# EasyEDA schematic SCH_PIEZO_CRYSTAL_DAC_2022-01-11.json

## Sheets
1 DACs: TITLE: Sheet_1; REV: 1.0; Date: 2021-10-22; Sheet: 1/1; Drawn By: Dimsmary; Company: Your Company
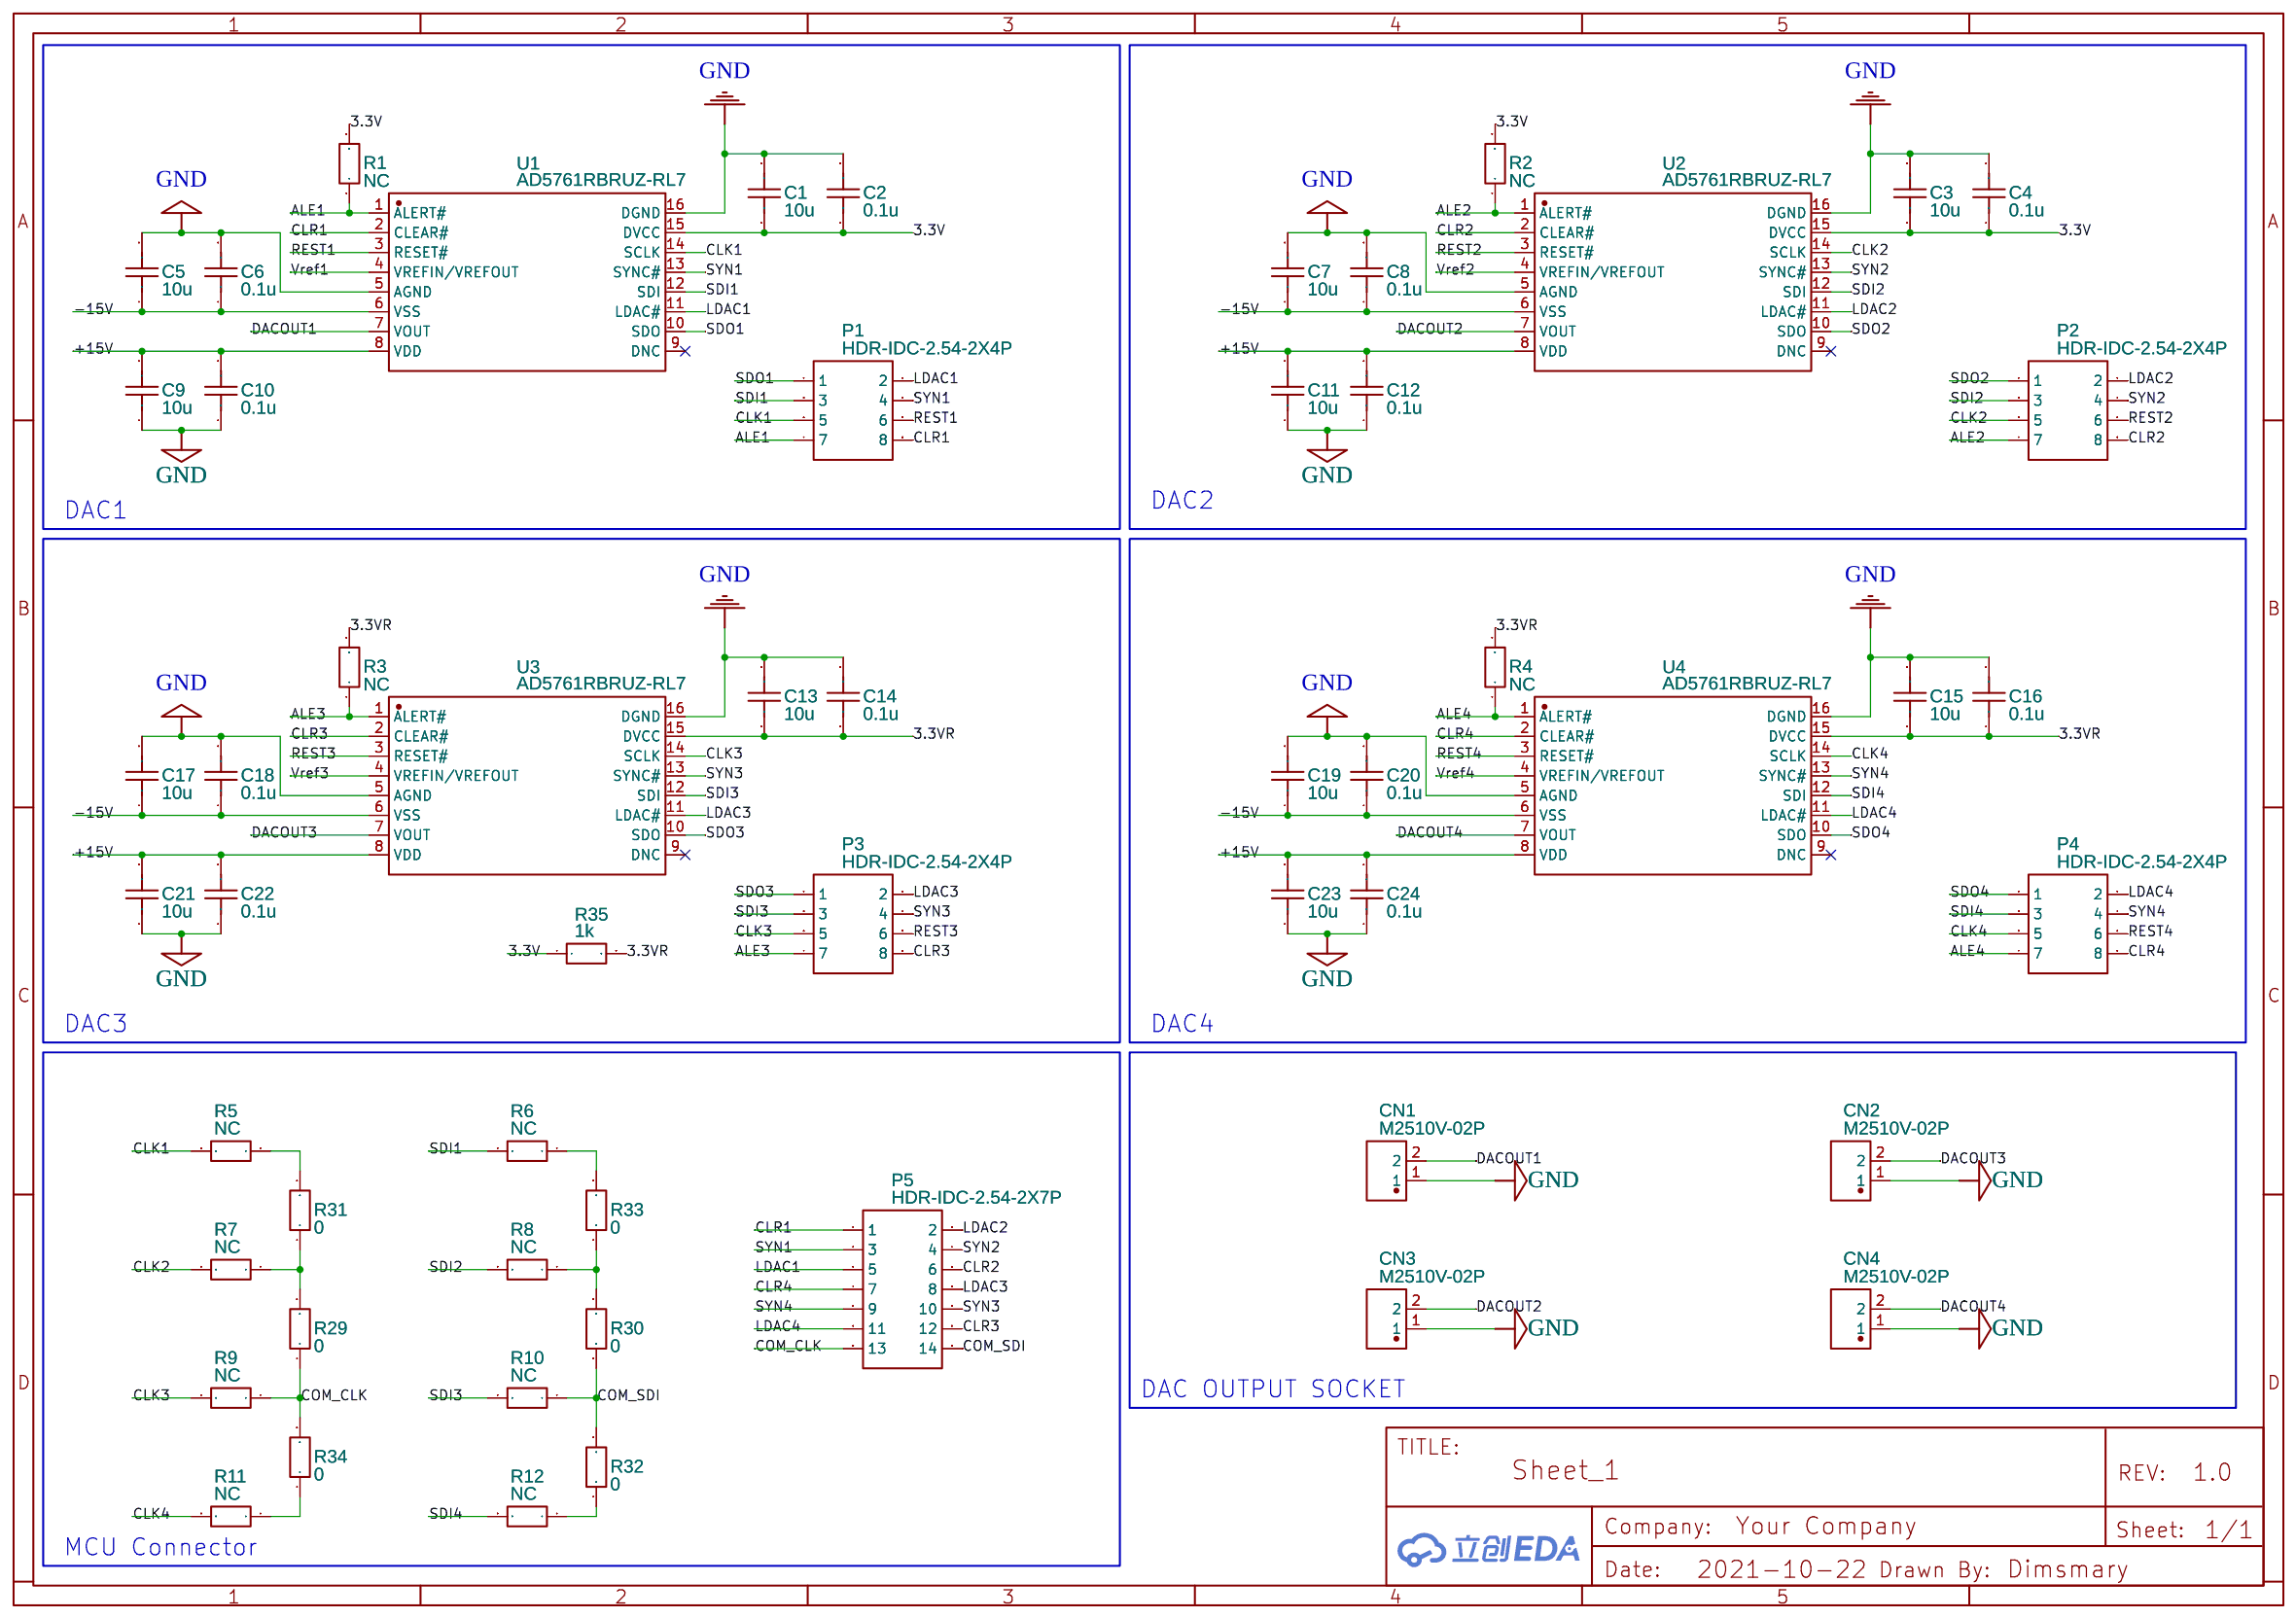
[diagram p0: DACs]
2 PowerRail: TITLE: Sheet_2; Date: 2021-10-23
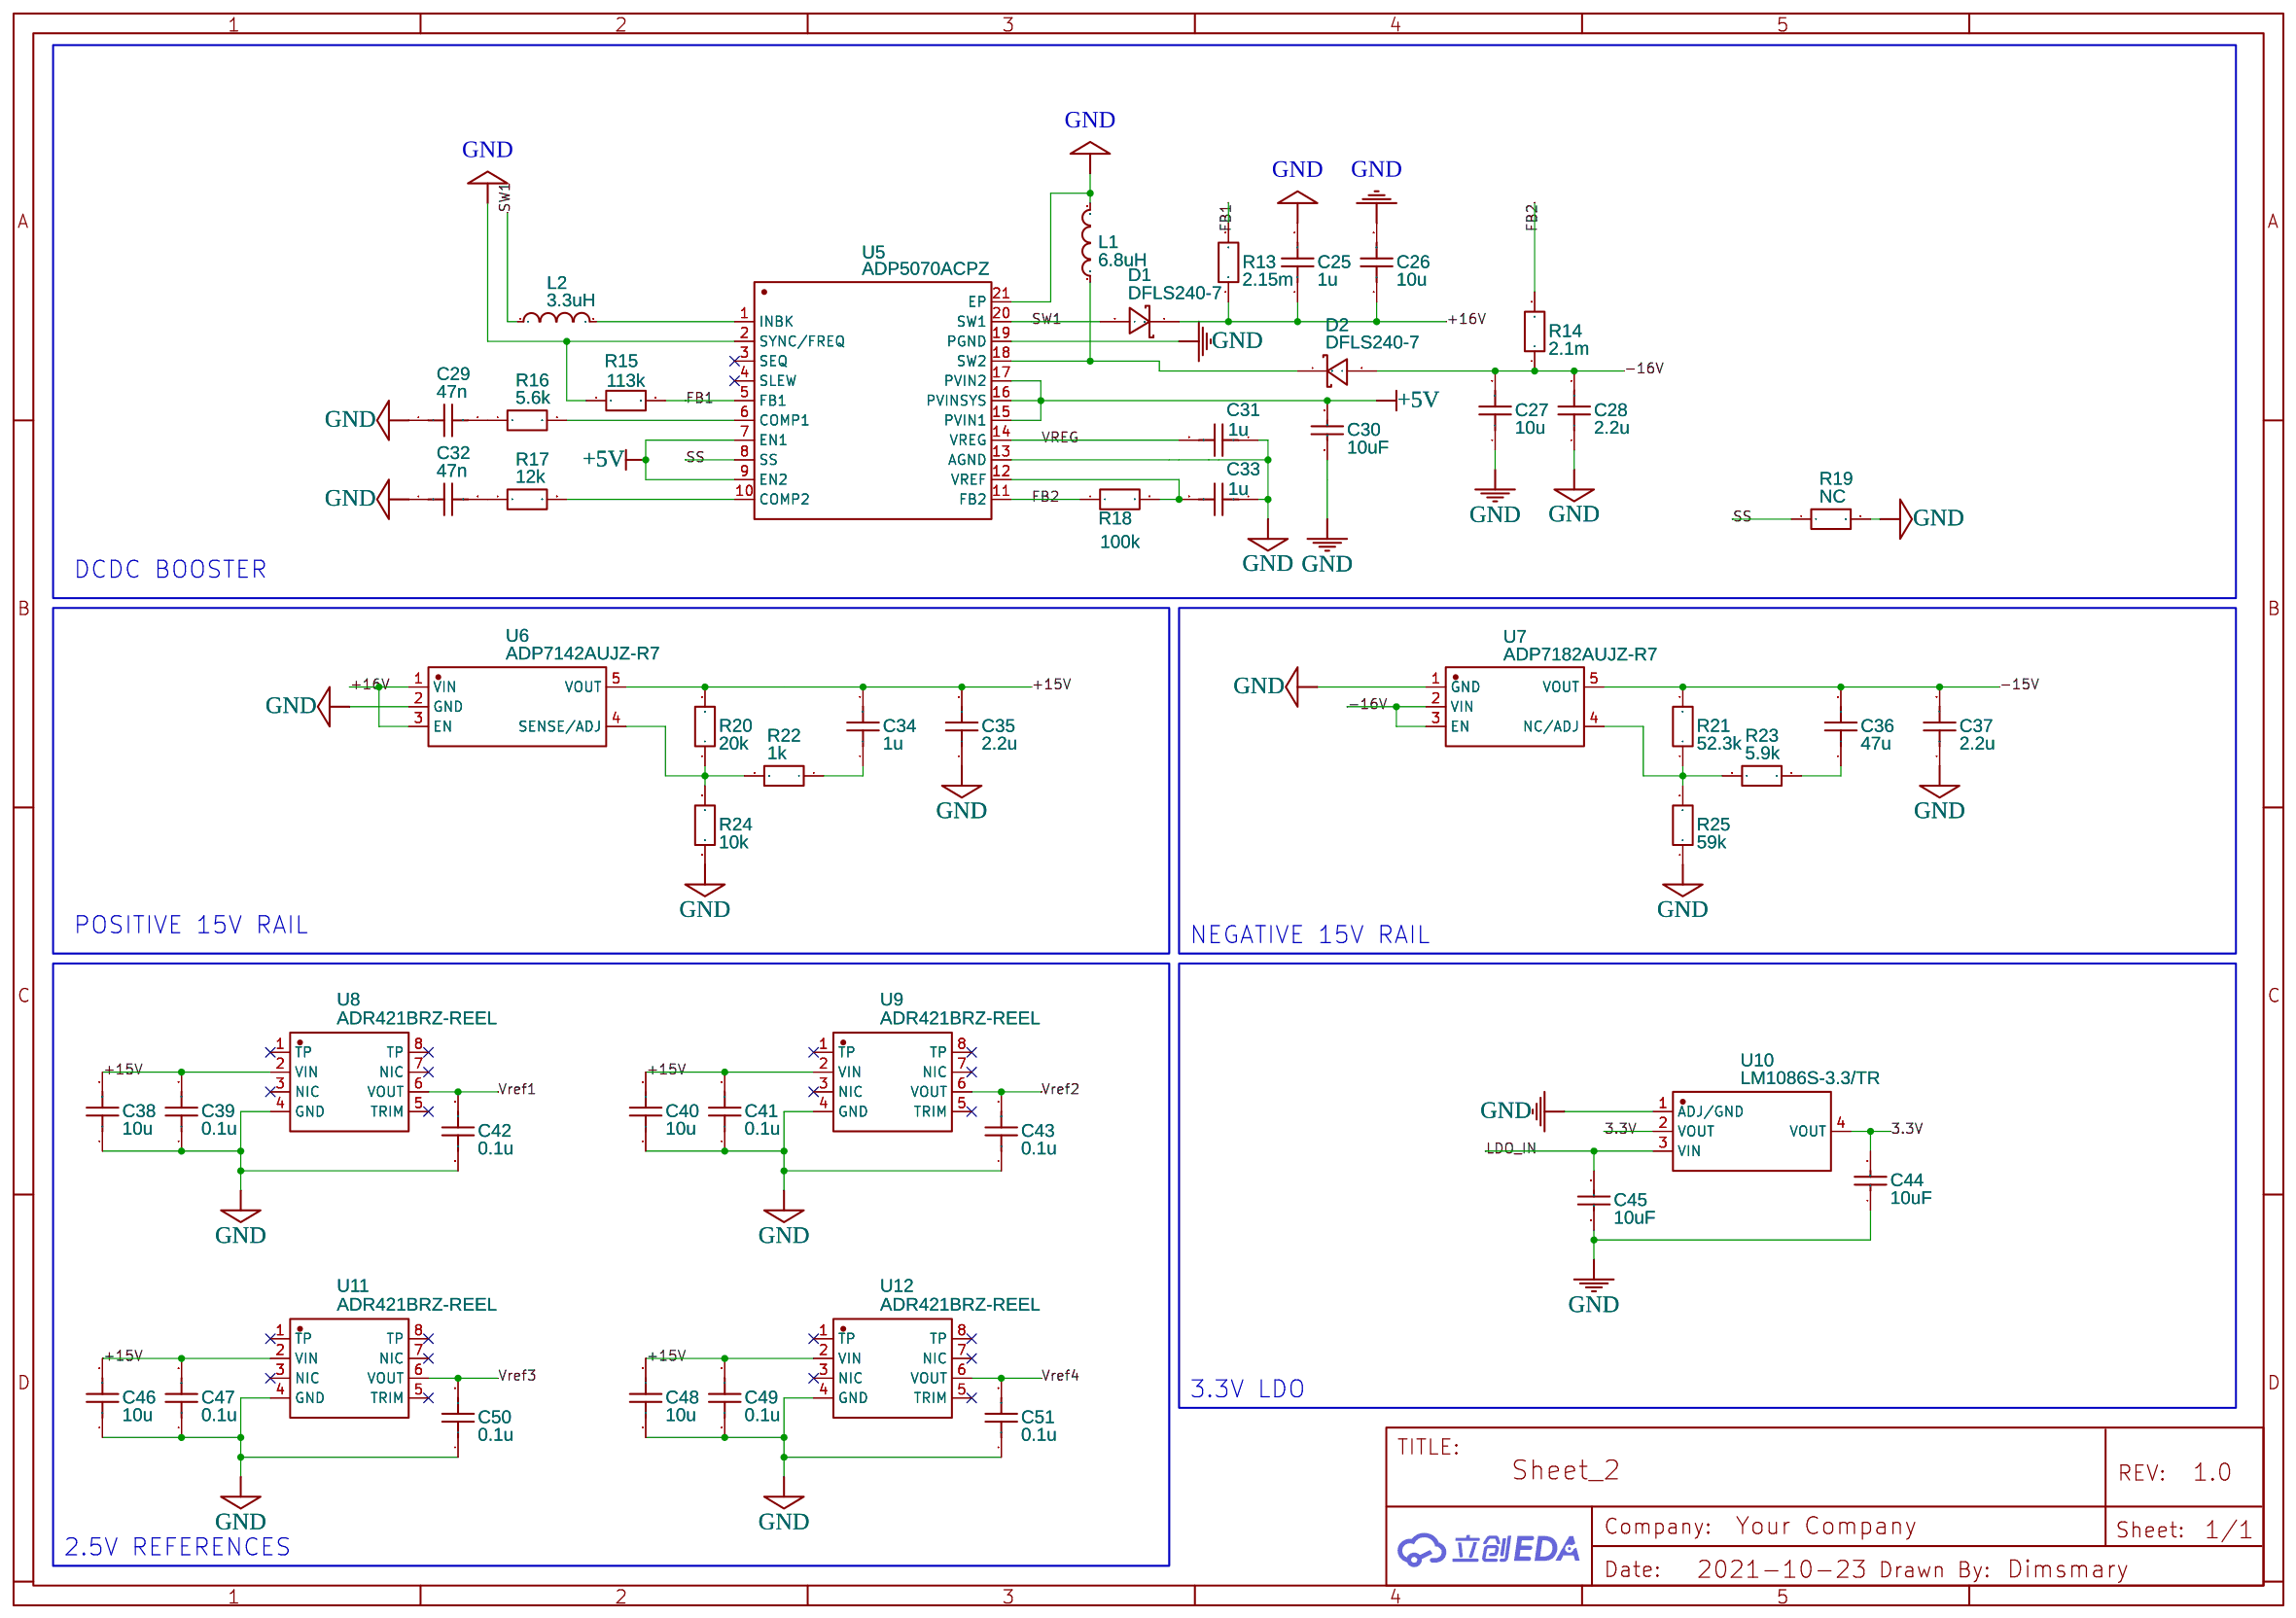
[diagram p1: PowerRail]
3 PowerInput: Date: 2021-10-25
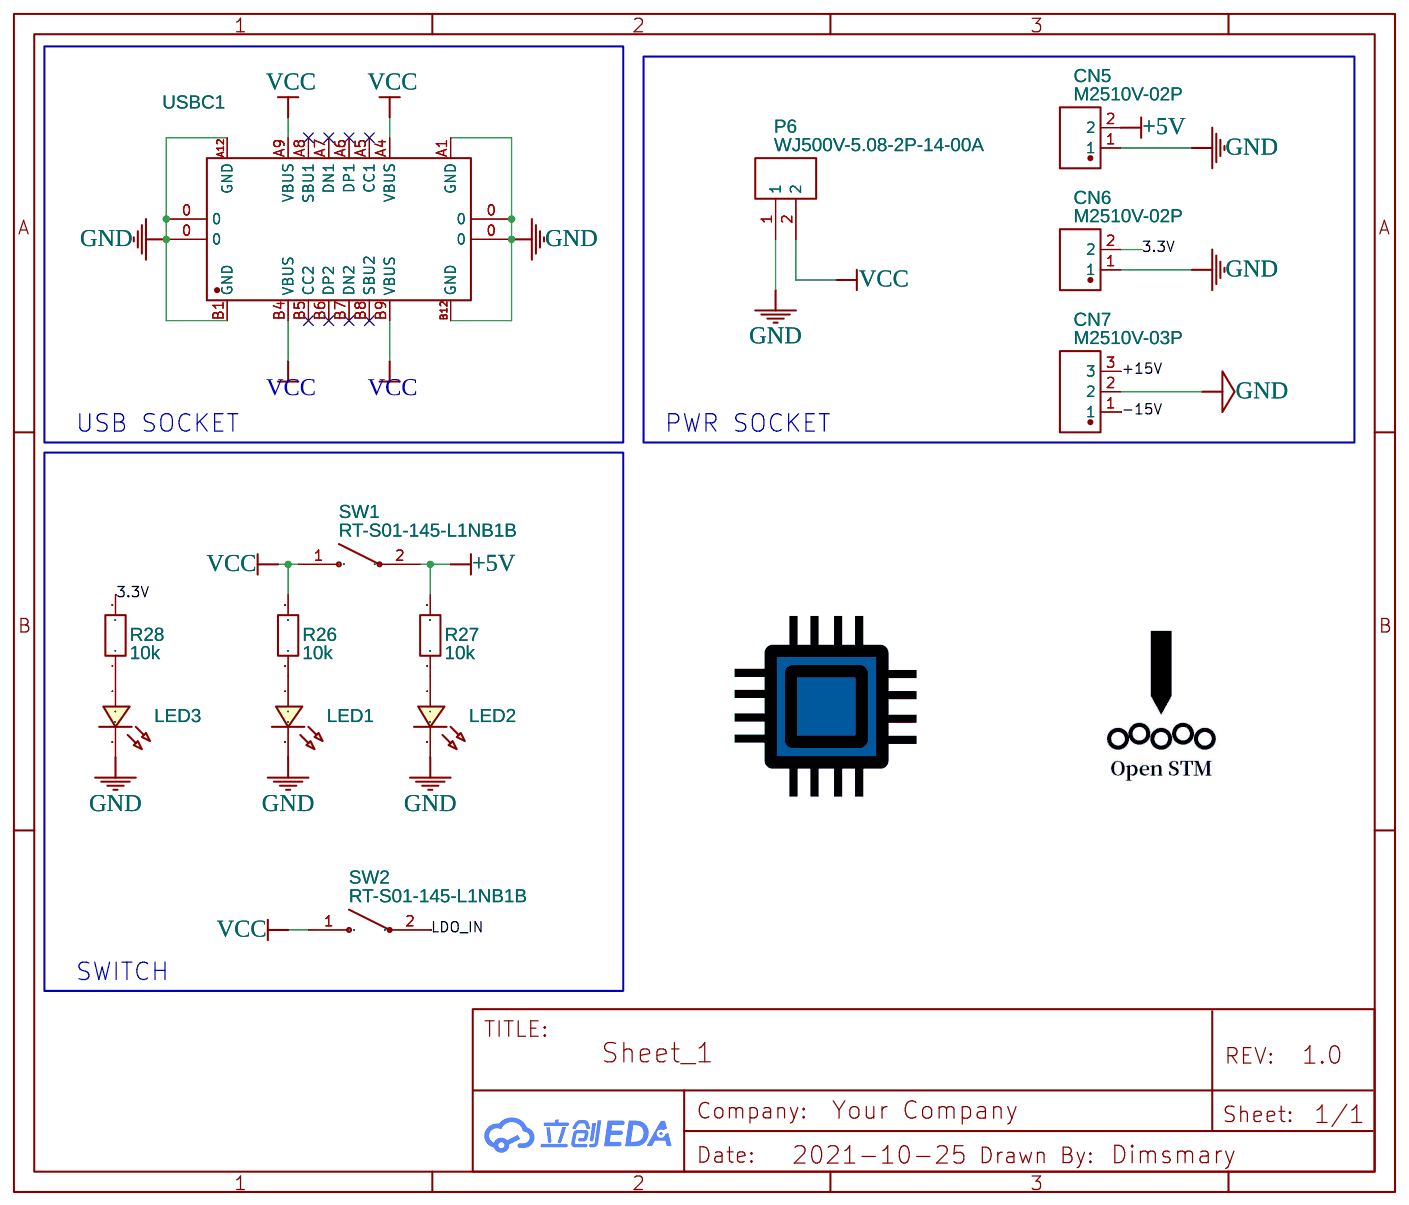
[diagram p2: PowerInput]

## Parts
sheet DACs
C1  10u  [C0603]
C2  0.1u  [C0603]
C3  10u  [C0603]
C4  0.1u  [C0603]
C5  10u  [C0603]
C6  0.1u  [C0603]
C7  10u  [C0603]
C8  0.1u  [C0603]
C9  10u  [C0603]
C10  0.1u  [C0603]
C11  10u  [C0603]
C12  0.1u  [C0603]
C13  10u  [C0603]
C14  0.1u  [C0603]
C15  10u  [C0603]
C16  0.1u  [C0603]
C17  10u  [C0603]
C18  0.1u  [C0603]
C19  10u  [C0603]
C20  0.1u  [C0603]
C21  10u  [C0603]
C22  0.1u  [C0603]
C23  10u  [C0603]
C24  0.1u  [C0603]
CN1  M2510V-02P  [CONN-TH_M2510V-02P]
CN2  M2510V-02P  [CONN-TH_M2510V-02P]
CN3  M2510V-02P  [CONN-TH_M2510V-02P]
CN4  M2510V-02P  [CONN-TH_M2510V-02P]
P1  HDR-IDC-2.54-2X4P  [IDC-TH_8P-P2.54-V-R2-C4-S2.54]
P2  HDR-IDC-2.54-2X4P  [IDC-TH_8P-P2.54-V-R2-C4-S2.54]
P3  HDR-IDC-2.54-2X4P  [IDC-TH_8P-P2.54-V-R2-C4-S2.54]
P4  HDR-IDC-2.54-2X4P  [IDC-TH_8P-P2.54-V-R2-C4-S2.54]
P5  HDR-IDC-2.54-2X7P  [IDC-TH_14P-P2.54-V-R2-C7-S2.54]
R1  NC  [R0603]
R2  NC  [R0603]
R3  NC  [R0603]
R4  NC  [R0603]
R5  NC  [R0603]
R6  NC  [R0603]
R7  NC  [R0603]
R8  NC  [R0603]
R9  NC  [R0603]
R10  NC  [R0603]
R11  NC  [R0603]
R12  NC  [R0603]
R29  0  [R1206]
R30  0  [R1206]
R31  0  [R1206]
R32  0  [R1206]
R33  0  [R1206]
R34  0  [R1206]
R35  1k  [R2512]
U1  AD5761RBRUZ-RL7  [TSSOP-16_L5.0-W4.4-P0.65-LS6.4-BL]
U2  AD5761RBRUZ-RL7  [TSSOP-16_L5.0-W4.4-P0.65-LS6.4-BL]
U3  AD5761RBRUZ-RL7  [TSSOP-16_L5.0-W4.4-P0.65-LS6.4-BL]
U4  AD5761RBRUZ-RL7  [TSSOP-16_L5.0-W4.4-P0.65-LS6.4-BL]
sheet PowerInput
CN5  M2510V-02P  [CONN-TH_M2510V-02P]
CN6  M2510V-02P  [CONN-TH_M2510V-02P]
CN7  M2510V-03P  [CONN-TH_M2510V-03P]
LED1  LED-0603_R  [LED0603_RED]
LED2  LED-0603_R  [LED0603_RED]
LED3  LED-0603_R  [LED0603_RED]
P6  WJ500V-5.08-2P-14-00A  [CONN-TH_2P-P5.00_WJ500V-5.08-2P]
R26  10k  [R0603]
R27  10k  [R0603]
R28  10k  [R0603]
SW1  RT-S01-145-L1NB1B  [SW-TH_RT-S01-145-L1NB1B]
SW2  RT-S01-145-L1NB1B  [SW-TH_RT-S01-145-L1NB1B]
USBC1  TYPE-C-31-M-12  [USB-TYPE-C_16PIN-MALE-TYPE-C-31-M-12-AK]
sheet PowerRail
C25  1u  [C0603]
C26  10u  [C0603]
C27  10u  [C0603]
C28  2.2u  [C0603]
C29  47n  [C0603]
C30  10uF  [C0805]
C31  1u  [C0603]
C32  47n  [C0603]
C33  1u  [C0603]
C34  1u  [C0603]
C35  2.2u  [C0603]
C36  47u  [C0603]
C37  2.2u  [C0603]
C38  10u  [C0603]
C39  0.1u  [C0603]
C40  10u  [C0603]
C41  0.1u  [C0603]
C42  0.1u  [C0603]
C43  0.1u  [C0603]
C44  10uF  [C0805]
C45  10uF  [C0805]
C46  10u  [C0603]
C47  0.1u  [C0603]
C48  10u  [C0603]
C49  0.1u  [C0603]
C50  0.1u  [C0603]
C51  0.1u  [C0603]
D1  DFLS240-7  [POWERDI-123_L2.8-W1.8-LS3.7-RD]
D2  DFLS240-7  [POWERDI-123_L2.8-W1.8-LS3.7-RD]
L1  6.8uH  [L0806]
L2  3.3uH  [IND-SMD_L2.0-W1.6]
R13  2.15m  [R0603]
R14  2.1m  [R0603]
R15  113k  [R0603]
R16  5.6k  [R0603]
R17  12k  [R0603]
R18  100k  [R0603]
R19  NC  [R0603]
R20  20k  [R0603]
R21  52.3k  [R0603]
R22  1k  [R0603]
R23  5.9k  [R0603]
R24  10k  [R0603]
R25  59k  [R0603]
U5  ADP5070ACPZ  [LFCSP-20_L4.0-W4.0-P0.50-TL-EP2.7]
U6  ADP7142AUJZ-R7  [TSOT-23-5_L2.9-W1.6-P0.95-LS2.8-BR]
U7  ADP7182AUJZ-R7  [TSOT-23-5_L2.9-W1.6-P0.95-LS2.8-BR]
U8  ADR421BRZ-REEL  [SOIC-8_L4.9-W3.9-P1.27-LS6.0-BL]
U9  ADR421BRZ-REEL  [SOIC-8_L4.9-W3.9-P1.27-LS6.0-BL]
U10  LM1086S-3.3/TR  [TO-263-3_L8.6-W10.2-P2.54-LS14.4-BR]
U11  ADR421BRZ-REEL  [SOIC-8_L4.9-W3.9-P1.27-LS6.0-BL]
U12  ADR421BRZ-REEL  [SOIC-8_L4.9-W3.9-P1.27-LS6.0-BL]

## Library data of the parts
C1-C29 C31-C43 C46-C51 = C_0603_US: Contributor: LCEDA_Lib
CN1-CN6 = M2510V-02P: Supplier: LCSC; Supplier Part: C2764790; Manufacturer: XFCN(台湾兴飞); JLCPCB Part Class: Extended Part; Contributor: LCSC
P1-P4 = HDR-IDC-2.54-2X4P: Supplier: LCSC; Manufacturer: BOOMELE; Manufacturer Part: IDC Box 2X4 2.54MM; image: //image.lceda.cn/szlcsc/C9135.jpg; Supplier Part: C9135
P5 = HDR-IDC-2.54-2X7P: Supplier: LCSC; Manufacturer: BOOMELE; Manufacturer Part: 2X7 2.54mm IDC Box; image: //image.lceda.cn/szlcsc/C11215.jpg; Supplier Part: C11215
R1-R28 = R_0603_EU: Contributor: LCEDA_Lib
R29-R34 = R_1206_EU: Contributor: LCEDA_Lib
R35 = R_2512_EU: Contributor: LCEDA_Lib
U1-U4 = AD5761RBRUZ-RL7: Supplier: LCSC; Supplier Part: C515877; Manufacturer: Analog Devices; Contributor: LCSC; JLCPCB Part Class: Extended Part
CN7 = M2510V-03P: Supplier: LCSC; Supplier Part: C2764791; Manufacturer: XFCN(台湾兴飞); JLCPCB Part Class: Extended Part; Contributor: LCSC
LED1-LED3 = LED-0603_R: Manufacturer: EVERLIGHT(台湾亿光); Manufacturer Part: 19-217/R6C-AL1M2VY/3T; Supplier Part: C72044; Supplier: LCSC; Contributor: LCEDA_01
P6 = WJ500V-5.08-2P-14-00A: Supplier: LCSC; Manufacturer: ReliaPro; Supplier Part: C8465; JLCPCB Part Class: Extended Part
SW1 SW2 = RT-S01-145-L1NB1B: Supplier: LCSC; Supplier Part: C312627; Manufacturer: ROCKTEK; Contributor: LCSC; JLCPCB Part Class: Extended Part
USBC1 = -: Supplier: LCSC; Supplier Part: C165948; Manufacturer: Rectangular Connectors - Contacts; Contributor: LCSC
C30 C44 C45 = CL21A106KOQNNNE: Supplier: LCSC; Manufacturer: SAMSUNG; Supplier Part: C1713; JLCPCB Part Class: Extended Part
D1 D2 = DFLS240-7: Supplier: LCSC; Manufacturer: DIODES; Contributor: LCSC; Supplier Part: C124195; JLCPCB Part Class: Extended Part
L1 = LBM2016T6R8J: Supplier: LCSC; Supplier Part: C222609; Manufacturer: Taiyo Yuden; Contributor: LCSC; JLCPCB Part Class: Extended Part
L2 = LBM2016T3R3J: Supplier: LCSC; Supplier Part: C222605; Manufacturer: Taiyo Yuden; Contributor: LCSC; JLCPCB Part Class: Extended Part
U5 = ADP5070ACPZ: Supplier: LCSC; Supplier Part: C659267; Manufacturer: ADI(亚德诺)/LINEAR; Contributor: LCSC; JLCPCB Part Class: Extended Part
U6 = ADP7142AUJZ-R7: Supplier: LCSC; Supplier Part: C514356; Manufacturer: Analog Devices; Contributor: LCSC; JLCPCB Part Class: Extended Part
U7 = ADP7182AUJZ-R7: Supplier: LCSC; Supplier Part: C514358; Manufacturer: Analog Devices; Contributor: LCSC; JLCPCB Part Class: Extended Part
U8 U9 U11 U12 = ADR421BRZ-REEL: Supplier: LCSC; Supplier Part: C496503; Manufacturer: Analog Devices; Contributor: LCSC; JLCPCB Part Class: Extended Part
U10 = LM1086S-3.3/TR: Supplier: LCSC; Supplier Part: C444378; Manufacturer: HGSEMI; Contributor: LCSC; JLCPCB Part Class: Extended Part

## Nets
3.3V: C1.1 C2.1 C3.1 C4.1 C44.2 CN6.2 R1.2 R2.2 R28.2 R35.1 U1.15(DVCC) U2.15(DVCC) U10.2(VOUT) U10.4(VOUT)
3.3VR: C13.1 C14.1 C15.1 C16.1 R3.2 R4.2 R35.2 U3.15(DVCC) U4.15(DVCC)
+5V: C30.2 CN5.2 R27.2 SW1.2 U5.7(EN1) U5.9(EN2) U5.15(PVIN1) U5.16(PVINSYS) U5.17(PVIN2)
+15V: C9.2 C10.2 C11.2 C12.2 C21.2 C22.2 C23.2 C24.2 C34.2 C35.2 C38.2 C39.2 C40.2 C41.2 C46.2 C47.2 C48.2 C49.2 CN7.3 R20.2 U1.8(VDD) U2.8(VDD) U3.8(VDD) U4.8(VDD) U6.5(VOUT) U8.2(VIN) U9.2(VIN) U11.2(VIN) U12.2(VIN)
+16V: C25.1 C26.1 D1.1(C) R13.1 U6.1(VIN) U6.3(EN)
-15V: C5.1 C6.1 C7.1 C8.1 C17.1 C18.1 C19.1 C20.1 C36.2 C37.2 CN7.1 R21.2 U1.6(VSS) U2.6(VSS) U3.6(VSS) U4.6(VSS) U7.5(VOUT)
-16V: C27.2 C28.2 D2.2(A) R14.1 U7.2(VIN) U7.3(EN)
GND: C1.2 C2.2 C3.2 C4.2 C5.2 C6.2 C7.2 C8.2 C9.1 C10.1 C11.1 C12.1 C13.2 C14.2 C15.2 C16.2 C17.2 C18.2 C19.2 C20.2 C21.1 C22.1 C23.1 C24.1 C25.2 C26.2 C27.1 C28.1 C29.1 C30.1 C31.1 C32.1 C33.1 C35.1 C37.1 C38.1 C39.1 C40.1 C41.1 C42.1 C43.1 C44.1 C45.1 C46.1 C47.1 C48.1 C49.1 C50.1 C51.1 CN1.1 CN2.1 CN3.1 CN4.1 CN5.1 CN6.1 CN7.2 L1.2 LED1.2 LED2.2 LED3.2 P6.1 R15.1 R19.2 R24.1 R25.1 U1.5(AGND) U1.16(DGND) U2.5(AGND) U2.16(DGND) U3.5(AGND) U3.16(DGND) U4.5(AGND) U4.16(DGND) U5.2(SYNC/FREQ) U5.13(AGND) U5.19(PGND) U5.21(EP) U6.2(GND) U7.1(GND) U8.4(GND) U9.4(GND) U10.1(ADJ/GND) U11.4(GND) U12.4(GND) USBC1.0 USBC1.A1(GND) USBC1.A12(GND) USBC1.B1(GND) USBC1.B12(GND)
VCC: P6.2 R26.2 SW1.1 SW2.1 USBC1.A4(VBUS) USBC1.A9(VBUS) USBC1.B4(VBUS) USBC1.B9(VBUS)
ALE1: P1.7 R1.1 U1.1(ALERT#)
ALE2: P2.7 R2.1 U2.1(ALERT#)
ALE3: P3.7 R3.1 U3.1(ALERT#)
ALE4: P4.7 R4.1 U4.1(ALERT#)
CLK1: P1.5 R5.2 U1.14(SCLK)
CLK2: P2.5 R7.2 U2.14(SCLK)
CLK3: P3.5 R9.2 U3.14(SCLK)
CLK4: P4.5 R11.2 U4.14(SCLK)
CLR1: P1.8 P5.1 U1.2(CLEAR#)
CLR2: P2.8 P5.6 U2.2(CLEAR#)
CLR3: P3.8 P5.12 U3.2(CLEAR#)
CLR4: P4.8 P5.7 U4.2(CLEAR#)
COM_CLK: P5.13 R9.1 R29.1 R34.2
COM_SDI: P5.14 R10.1 R30.1 R32.2
DACOUT1: CN1.2 U1.7(VOUT)
DACOUT2: CN3.2 U2.7(VOUT)
DACOUT3: CN2.2 U3.7(VOUT)
DACOUT4: CN4.2 U4.7(VOUT)
FB1: R13.2 R15.2 U5.5(FB1)
FB2: R14.2 R18.1 U5.11(FB2)
LDAC1: P1.2 P5.5 U1.11(LDAC#)
LDAC2: P2.2 P5.2 U2.11(LDAC#)
LDAC3: P3.2 P5.8 U3.11(LDAC#)
LDAC4: P4.2 P5.11 U4.11(LDAC#)
LDO_IN: C45.2 SW2.2 U10.3(VIN)
REST1: P1.6 U1.3(RESET#)
REST2: P2.6 U2.3(RESET#)
REST3: P3.6 U3.3(RESET#)
REST4: P4.6 U4.3(RESET#)
SDI1: P1.3 R6.2 U1.12(SDI)
SDI2: P2.3 R8.2 U2.12(SDI)
SDI3: P3.3 R10.2 U3.12(SDI)
SDI4: P4.3 R12.2 U4.12(SDI)
SDO1: P1.1 U1.10(SDO)
SDO2: P2.1 U2.10(SDO)
SDO3: P3.1 U3.10(SDO)
SDO4: P4.1 U4.10(SDO)
SS: R19.1 U5.8(SS)
SW1: D1.2(A) L2.1 U5.20(SW1)
SYN1: P1.4 P5.3 U1.13(SYNC#)
SYN2: P2.4 P5.4 U2.13(SYNC#)
SYN3: P3.4 P5.10 U3.13(SYNC#)
SYN4: P4.4 P5.9 U4.13(SYNC#)
Vref1: C42.2 U1.4(VREFIN/VREFOUT) U8.6(VOUT)
Vref2: C43.2 U2.4(VREFIN/VREFOUT) U9.6(VOUT)
Vref3: C50.2 U3.4(VREFIN/VREFOUT) U11.6(VOUT)
Vref4: C51.2 U4.4(VREFIN/VREFOUT) U12.6(VOUT)
VREG: C31.2 U5.14(VREG)
Net-(C29-2): C29.2 R16.1
Net-(C32-2): C32.2 R17.1
Net-(C33-2): C33.2 R18.2 U5.12(VREF)
Net-(C34-1): C34.1 R22.1
Net-(C36-1): C36.1 R23.1
Net-(D2-1): D2.1(C) L1.1 U5.18(SW2)
Net-(L2-2): L2.2 U5.1(INBK)
Net-(LED1-1): LED1.1 R26.1
Net-(LED2-1): LED2.1 R27.1
Net-(LED3-1): LED3.1 R28.1
Net-(R5-1): R5.1 R31.2
Net-(R6-1): R6.1 R33.2
Net-(R7-1): R7.1 R29.2 R31.1
Net-(R8-1): R8.1 R30.2 R33.1
Net-(R11-1): R11.1 R34.1
Net-(R12-1): R12.1 R32.1
Net-(R16-2): R16.2 U5.6(COMP1)
Net-(R17-2): R17.2 U5.10(COMP2)
Net-(R20-1): R20.1 R22.2 R24.2 U6.4(SENSE/ADJ)
Net-(R21-1): R21.1 R23.2 R25.2 U7.4(NC/ADJ)

Not connected (* = marked no-connect by the designer): U1 9(DNC)*; U2 9(DNC)*; U3 9(DNC)*; U4 9(DNC)*; U5 3(SEQ)* 4(SLEW)*; U8 1(TP)* 3(NIC)* 5(TRIM)* 7(NIC)* 8(TP)*; U9 1(TP)* 3(NIC)* 5(TRIM)* 7(NIC)* 8(TP)*; U11 1(TP)* 3(NIC)* 5(TRIM)* 7(NIC)* 8(TP)*; U12 1(TP)* 3(NIC)* 5(TRIM)* 7(NIC)* 8(TP)*; USBC1 A5(CC1)* A6(DP1)* A7(DN1)* A8(SBU1)* B5(CC2)* B6(DP2)* B7(DN2)* B8(SBU2)*

## Notes on the sheets
sheet 1
- DAC2
- DAC1
- DAC3
- DAC4
- DAC OUTPUT SOCKET
- MCU Connector
sheet 2
- DCDC BOOSTER
- POSITIVE 15V RAIL
- NEGATIVE 15V RAIL
- 3.3V LDO
- 2.5V REFERENCES
sheet 3
- USB SOCKET
- PWR SOCKET
- SWITCH
